# EAGLE design ble_minirc (EAGLE 8.7.0)
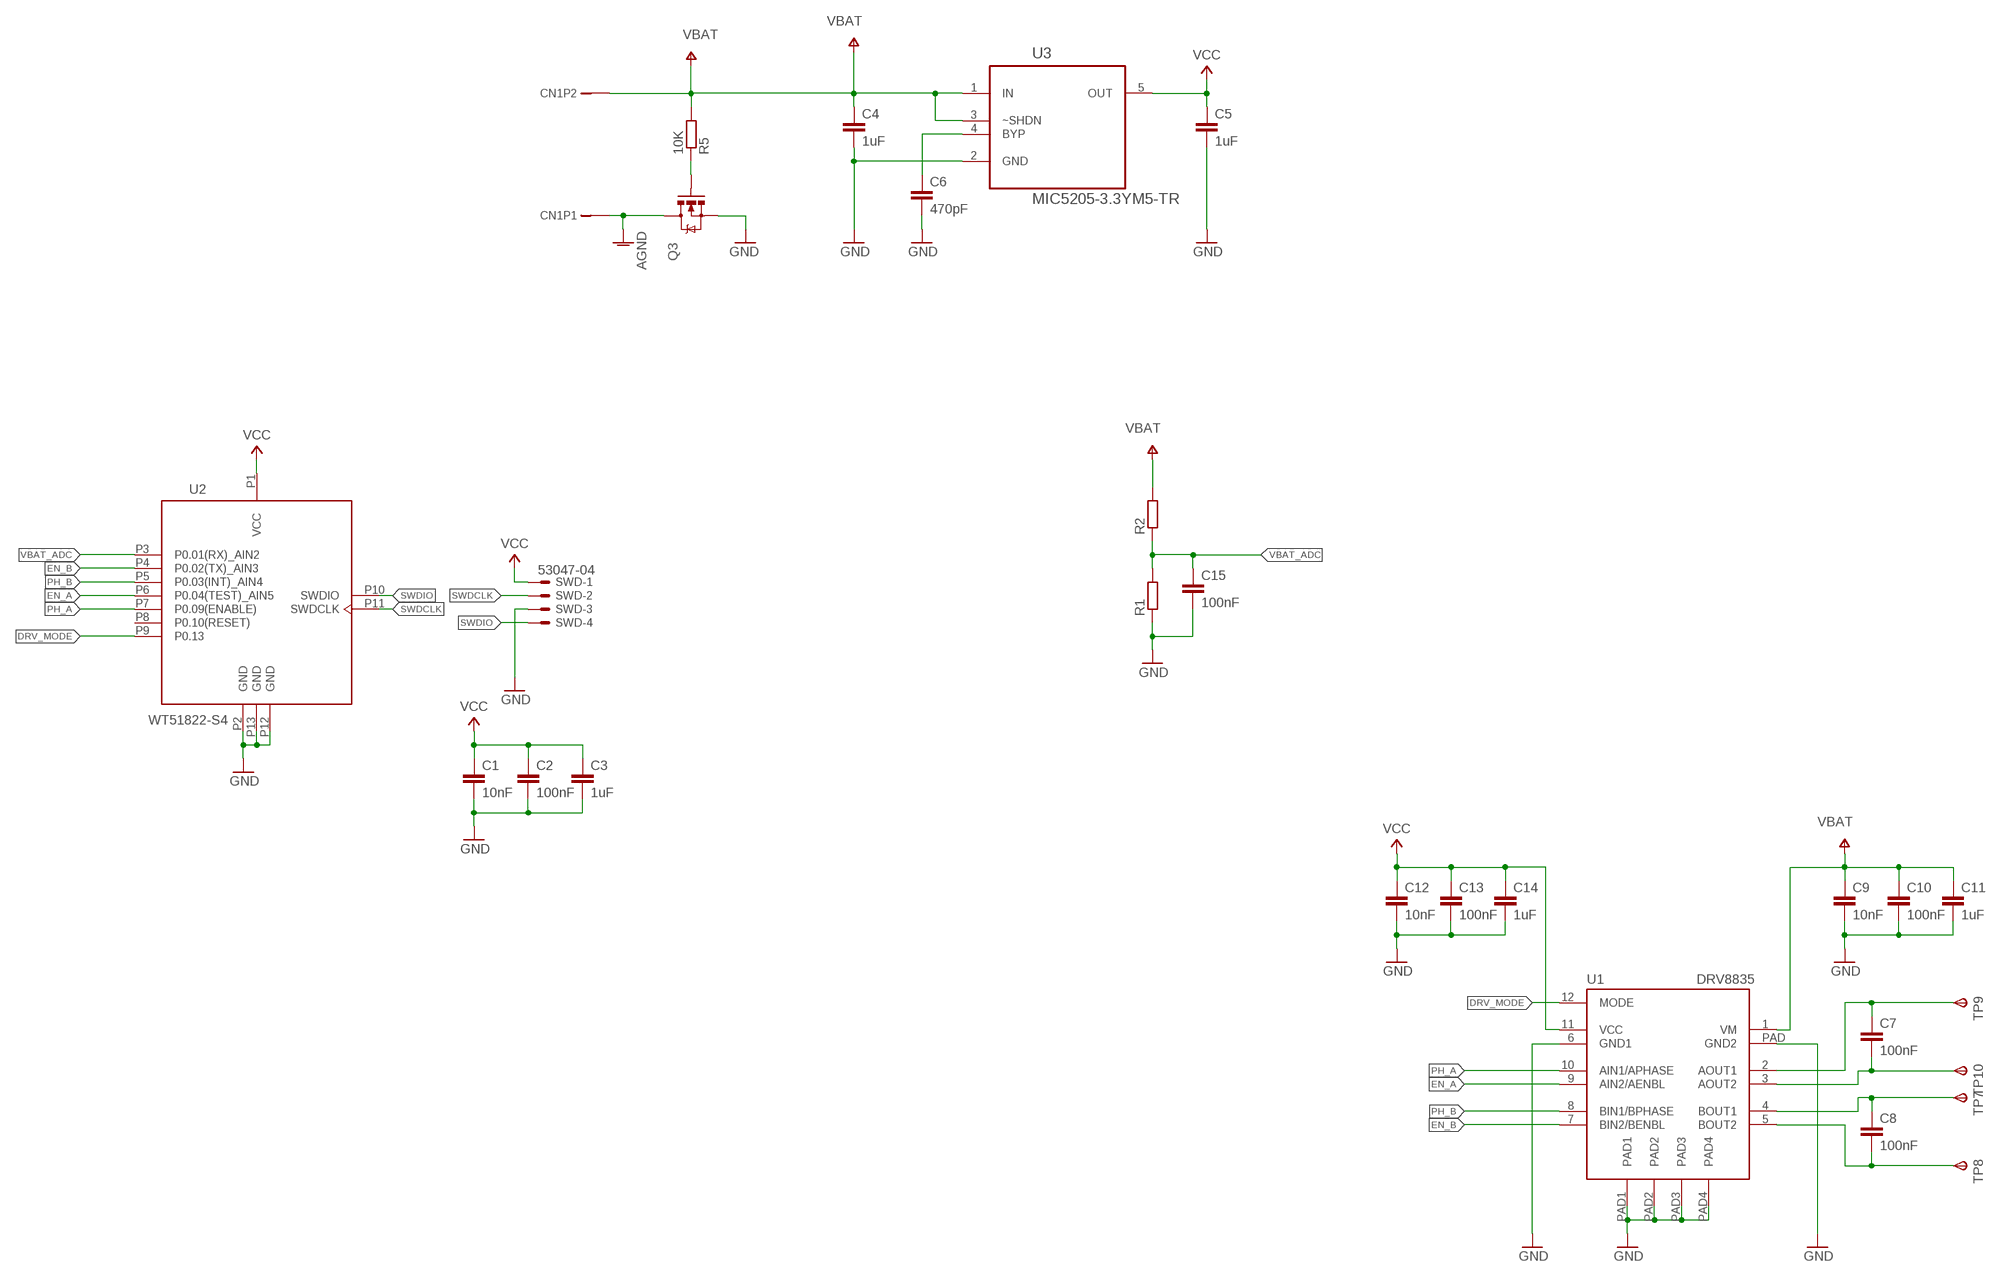
[diagram p0: schematic, sheet 1]

## Parts
C1  10nF  C-EUC0603  [C0603]
C2  100nF  C-EUC0603  [C0603]
C3  1uF  C-EUC0603  [C0603]
C4  1uF  C-EUC0603  [C0603]
C5  1uF  C-EUC0603  [C0603]
C6  470pF  C-EUC0603  [C0603]
C7  100nF  C-EUC0603  [C0603]
C8  100nF  C-EUC0603  [C0603]
C9  10nF  C-EUC0603  [C0603]
C10  100nF  C-EUC0603  [C0603]
C11  1uF  C-EUC0603  [C0603]
C12  10nF  C-EUC0603  [C0603]
C13  100nF  C-EUC0603  [C0603]
C14  1uF  C-EUC0603  [C0603]
C15  100nF  C-EUC0603  [C0603]
CN1  B2B-PH-K-S  [B2B-PH-K-S]
Q3  MOSFET-NCHANNELSMD  [SOT23-3]
R1  R-EU_R0603  [R0603]
R2  R-EU_R0603  [R0603]
R5  10K  R-EU_R0603  [R0603]
SWD  53047-04  [53047-04]
TP7  TPSB1,27  [B1,27]
TP8  TPSB1,27  [B1,27]
TP9  TPSB1,27  [B1,27]
TP10  TPSB1,27  [B1,27]
U1  DRV8835  [WSON_2X3]
U2  WT51822-S4  WT51822-S4ATMODULE  [WT51822-S4AT]
U3  MIC5205-3.3YM5-TR  LT1761ES5-3.3TRMPBF  [SOT95P280X145-5N]

## Nets
A1: C7.1 TP9.TP(PP) U1.2(AOUT1)
A2: C7.2 TP10.TP(PP) U1.3(AOUT2)
AGND: CN1.1 Q3.3(D)
ANTISTUPID_GATE: Q3.1(G) R5.1
B1: C8.1 TP7.TP(PP) U1.4(BOUT1)
B2: C8.2 TP8.TP(PP) U1.5(BOUT2)
DRV_MODE: U1.12(MODE) U2.P9(P0.13)
EN_A: U1.9(AIN2/AENBL) U2.P6(P0.04(TEST)_AIN5)
EN_B: U1.7(BIN2/BENBL) U2.P4(P0.02(TX)_AIN3)
GND: C1.2 C2.2 C3.2 C4.2 C5.2 C6.2 C9.2 C10.2 C11.2 C12.2 C13.2 C14.2 C15.2 Q3.2(S) R1.1 SWD.3 U1.6(GND1) U1.PAD1 U1.PAD2 U1.PAD3 U1.PAD4 U1.PAD(GND2) U2.P2(GND) U2.P12(GND) U2.P13(GND) U3.2(GND)
MIC_BYPASS: C6.1 U3.4(BYP)
PH_A: U1.10(AIN1/APHASE) U2.P7(P0.09(ENABLE))
PH_B: U1.8(BIN1/BPHASE) U2.P5(P0.03(INT)_AIN4)
SWDCLK: SWD.2 U2.P11(SWDCLK)
SWDIO: SWD.4 U2.P10(SWDIO)
VBAT: C4.1 C9.1 C10.1 C11.1 CN1.2 R2.2 R5.2 U1.1(VM) U3.1(IN) U3.3(~SHDN)
VBAT_ADC: C15.1 R1.2 R2.1 U2.P3(P0.01(RX)_AIN2)
VCC: C1.1 C2.1 C3.1 C5.1 C12.1 C13.1 C14.1 SWD.1 U1.11(VCC) U2.P1(VCC) U3.5(OUT)
Unconnected: U2.P8(P0.10(RESET))

## Library data of the parts
C1-C15 = rcl:C-EU: CAPACITOR, European symbol
CN1 = con-jst:B2B-PH-K-S; OC_TME: B2B-PH-K-S
Q3 = SparkFun:MOSFET-NCHANNEL
R1 R2 R5 = rcl:R-EU_: RESISTOR, European symbol
SWD = con-molex:53?-04: CONNECTOR wire to board 1.25 mm (.049 inch) pitch header; MF: WALDOM/MOLEX; MPN: 53047-0410; OC_FARNELL: 9733060; OC_NEWARK: 38C9900
TP7-TP10 = testpad:TPS: TEST PIN
U1 = bt_motordriver:DRV8835: DRV8835 DUAL LOW VOLTAGE H-BRIDGE IC The DRV8835 provides an integrated motor driver solution for cameras, consumer products, toys, and other low voltage or battery-powered motion control applications. The device has two H-bridge drivers, and can drive two DC motors or one stepper motor, as well as other devices like solenoids. The device has two H-bridge drivers, and drives two DC motors or one stepper motor, as well as other devices like solenoids. The output driver block for each consists of N-channel power MOSFETs configured as an H-bridge to drive the motor winding. An internal charge pump generates gate drive voltages. 1.5-A Maximum Drive Current Per H-Bridge Configure Bridges Parallel for 3-A Drive Curren 0-V to 11-V Motor-Operating Supply-Voltage 2-V to 7-V Logic Supply-Voltage Flexible PWM or PHASE/ENABLE Interface Low-Power Sleep Mode With 95-nA Maximum Supply Current Tiny 2.00-mm × 3.00-mm WSON Package Reference: http://www.ti.com/lit/ds/symlink/drv8835.pdf
U2 = martonmiklos:WT51822-S4AT: WT51822-S4AT is a high performance, low power radio transmit and receive system module use Nordic BLE 4.1 nRF51822 as the controller chips.
U3 = LTC_By_element14_Batch_1:LT1761ES5-3.3TRMPBF: 100mA, Low Noise, LDO Micropower Regulators; MPN: LT1761ES5-3.3#TRMPBF; OC_FARNELL: 1663779; OC_NEWARK: 19P0920; OC_TME: MIC5205-3.3YM5-TR; PACKAGE: SOT-23-5; SUPPLIER: Linear Technology

## Board
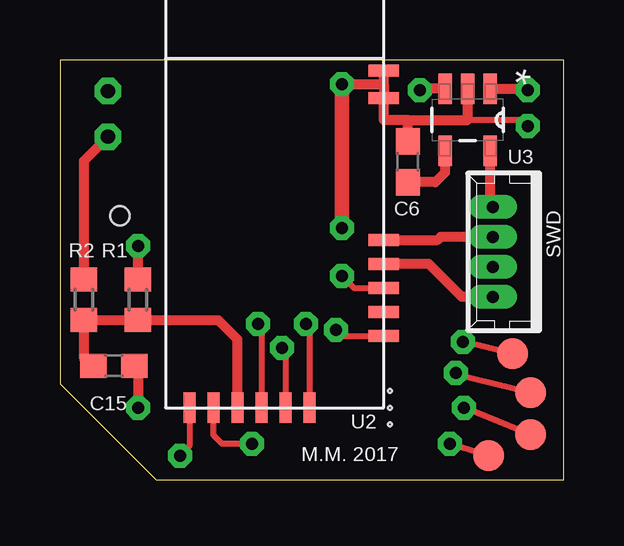
[diagram p1: board, top side]
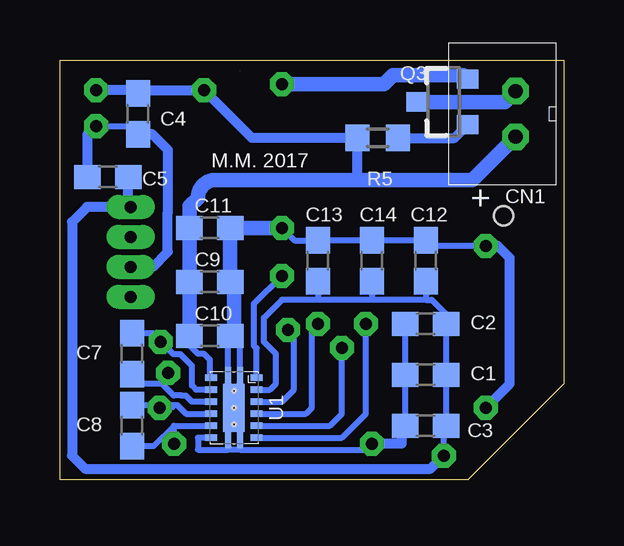
[diagram p2: board, bottom side, seen from below]

Size 21 x 17.5 mm. Coordinates in mm from the lower left corner, seen from the top.
Outline: 4,0 21,0 21,17.5 0,17.5 0,4 4,0
Copper layers (1*16): Top 0.035mm / dielectric 1.5mm / Bottom 0.035mm
Design rules "dirt_cheap_dirty_boards.v1": minimum track width 5mil, minimum drill 0.3mm, track to track 6mil, track to pad 6mil, pad to pad 6mil, via to via 6mil, smd to smd 0mil, copper to edge 10mil, drill to drill 10mil, minimum pad ring 10mil, minimum via ring 6mil, stop-mask expansion 2mil, vias tented up to drill 25mil, thermal gap 10mil
Holes 0.8 mm at 2.5,11

### Footprints (pad centres in the part's own frame; a part is rotated, then mirrored left to right if it is on the bottom)
C0603 = smd 1.1 x 1: 1 -0.85,0; 2 0.85,0
B2B-PH-K-S = drill 0.6 pad 1.016 octagon: 1 1.95,0; 2 0.05,0
SOT23-3 = smd 0.8 x 0.9: 1 -0.95,-1; 2 0.95,-1; 3 0,1.1
R0603 = smd 1 x 1.1: 1 -0.85,0; 2 0.85,0
53047-04 = drill 0.5 pad 0.698 long: 1 1.875,0.45; 2 0.625,0.45; 3 -0.625,0.45; 4 -1.875,0.45
B1,27 = smd 1.27 x 1.27: TP 0,0
WSON_2X3 = smd 0.28 x 0.5: 1 -1.25,-0.95; 2 -0.75,-0.95; 3 -0.25,-0.95; 4 0.25,-0.95; 5 0.75,-0.95; 6 1.25,-0.95; 7 1.25,0.95; 8 0.75,0.95; 9 0.25,0.95; 10 -0.25,0.95; 11 -0.75,0.95; 12 -1.25,0.95 | smd 2 x 0.9: PAD 0,0 | smd 0.7 x 0.25: PAD1 -1.35,0.25; PAD2 -1.35,-0.25; PAD3 1.35,-0.25; PAD4 1.35,0.25 | hole 0.15: 0,0; -0.7,0; 0.7,0
WT51822-S4AT = smd 1.27 x 0.5: P1 0,8.1; P2 0,7.1; P3 0,6.1; P4 0,5.1; P5 0,4.1; P6 0,3.1 | smd 0.5 x 1.27: P7 3,0; P8 4,0; P9 5,0; P10 6,0; P11 7,0; P12 12.9,0; P13 14.05,0
SOT95P280X145-5N = smd 1.27 x 0.559: 1 -1.295,0.94; 2 -1.295,0; 3 -1.295,-0.94; 4 1.295,-0.94; 5 1.295,0.94

### Placement (x,y rotation side)
C1  5.75,4.38 180 bottom
C2  5.75,6.5 180 bottom
C3  5.75,2.25 180 bottom
C4  17.75,15.25 270 bottom
C5  19,12.62 180 bottom
C6  14.5,13.25 90 top
C7  18,5.25 270 bottom
C8  18,2.25 270 bottom
C9  14.75,8.25 0 bottom
C10  14.75,6 0 bottom
C11  14.75,10.5 0 bottom
C12  5.75,9.12 90 bottom
C13  10.25,9.12 90 bottom
C14  8,9.12 90 bottom
C15  2.25,4.75 0 top
CN1  2,14.25 90 bottom
Q3  5,15.75 90 bottom
R1  3.25,7.5 270 top
R2  1,7.5 90 top
R5  7.75,14.25 180 bottom
SWD  18.5,9.5 90 top
TP7  19.62,1.88 90 top
TP8  17.88,1 90 top
TP9  18.88,5.25 90 top
TP10  19.62,3.62 90 top
U1  13.75,3 270 bottom
U2  13.5,3 90 top
U3  17,15 270 top

### Tracks (layer width: path | path; a pad name or v marks a point on that pad's centre or on a via)
A1  (via drill 0.5 pad 1)
  Top 0.254: TP9.TP 16.88,5.75 v16.8,5.75 16.75,5.75
  Bottom 0.254: U1.2 15.32,3.75 15.5,3.92 15.5,4.75 15.97,5.22 16.27,5.22 16.43,5.38 16.43,5.43 16.8,5.8 | C7.1 17.1,6.1 16.8,5.8 | v16.8,5.75 16.8,5.8
A2  (via drill 0.5 pad 1)
  Top 0.254: v16.5,4.44 16.56,4.38 TP10.TP
  Bottom 0.254: U1.3 15.5,3.25 15.75,3.5 15.93,3.5 15.93,3.51 16.26,3.51 16.75,4 | 16.75,4 17.6,4 C7.2 | v16.5,4.44 16.5,4.25 16.75,4
AGND
  Bottom 0.61: Q3.3 2.45,15.75 CN1.1
ANTISTUPID_GATE
  Bottom 0.406: R5.1 4.55,14.25 Q3.1
B1  (via drill 0.5 pad 1)
  Top 0.254: TP7.TP 16.88,3 16.75,2.9 v16.85,3
  Bottom 0.254: U1.4 15.75,2.75 16.1,3.1 16.25,3.1 | 16.25,3.1 C8.1 | 16.25,3.1 16.35,3 v16.85,3
B2  (via drill 0.5 pad 1)
  Top 0.254: TP8.TP v16.25,1.5
  Bottom 0.254: 16.25,2.25 17.1,1.4 C8.2 | 16.25,2.25 U1.5 | v16.25,1.5 16.25,2.25
DRV_MODE  (via drill 0.5 pad 1)
  Top 0.254: v11.75,8.5 12.25,8 U2.P9
  Bottom 0.254: U1.12 12.8,5.47 12.91,5.58 12.91,7.34 v11.75,8.5
EN_A  (via drill 0.5 pad 1)
  Top 0.254: v10.25,6.5 arc-90 10.4,6.35 U2.P6
  Bottom 0.254: U1.9 10.75,2.75 10.5,3 10.5,6.25 v10.25,6.5
EN_B  (via drill 0.5 pad 1)
  Top 0.254: v8.25,6.5 arc-90 8.4,6.35 U2.P4
  Bottom 0.254: U1.7 9.25,1.75 8.25,2.75 v8.25,6.5
GND  (via drill 0.5 pad 1)  (1 unrouted)
  Top 0.254: v19.5,14.75 arc90 19.25,15 17,15 | v8,1.5 6.75,1.5 6.4,1.85 U2.P2
  Top 0.406: 13.5,16.5 U2.P12 13.5,15 14.5,15 | 13.5,16.5 U2.P13 | U3.2 17,15 14.5,15 | v11.75,16.5 13.5,16.5 | C15.2 3.25,4.6 v3.25,3 | R1.1 v3.25,9.75 | C6.2 14.5,15
  Top 0.61: v11.75,10.5 v11.75,16.5
  Bottom 0.254: 6.67,2.17 C3.2 C1.2 C2.2 | C13.2 C14.2 C12.2 5.9,9.75 v3.25,9.75 | C13.2 10.5,9.97 | 10.5,9.97 10.4,9.85 10.25,9.75 | 10.25,9.75 10.6,9.75 10.5,9.97 | C13.2 11.22,9.97 v11.75,10.5 | C13.2 10.25,9.75 | U1.PAD3 14,1.91 | C4.2 17.6,14.75 v19.5,14.75 | v8,1.5 8.25,1.25 13.5,1.25 | U1.PAD3 14,2.15 U1.PAD 13.5,3.85 U1.PAD1 13.5,5.85 13.75,5.85 | 14,1.25 U1.PAD3 | 13.5,1.25 14,1.25 | U1.PAD4 13.5,1.25 | U1.PAD2 14,6 C10.2 | U1.6 15.25,1.75 15.25,1.25 14,1.25
  Bottom 0.406: v3.25,3 2.25,4 2.25,9.25 2.75,9.75 v3.25,9.75 | SWD.3 17.12,8.88 16.51,9.49 16.51,11.15 16.5,11.15 16.5,13.75 17.15,14.4 C4.2 | C5.2 19.85,14.4 v19.5,14.75 | v8,1.5 6.75,1.5 6.75,2.1 6.67,2.17
  Bottom 0.61: C10.2 13.75,5.85 13.75,7.85 C9.2 C11.2 v11.75,10.5 | Q3.2 4.17,16.88 7.12,16.88 7.5,16.5 v11.75,16.5
MIC_BYPASS
  Top 0.406: U3.4 16.06,12.81 15.65,12.4 C6.1
PH_A  (via drill 0.5 pad 1)
  Top 0.254: v11.5,6.25 11.75,6 U2.P7
  Bottom 0.254: U1.10 11.75,3.25 11.25,3.75 11.25,6 v11.5,6.25
PH_B  (via drill 0.5 pad 1)
  Top 0.254: v9.25,5.5 9.4,5.35 U2.P5
  Bottom 0.254: U1.8 9.75,2.25 9.25,2.75 v9.25,5.5
SWDCLK
  Top 0.406: U2.P11 15.75,10 15.88,10.12 SWD.2
SWDIO
  Top 0.406: SWD.4 16.75,7.62 15.38,9 U2.P10
VBAT  (via drill 0.5 pad 1)
  Top 0.406: U3.3 15.04,16.3 v15,16.25 | U3.1 19.2,16.3 v19.5,16.25 | R2.2 1,13.3 CN1.2
  Bottom 0.254: 17.75,16.25 C4.1 17.85,16.1 18,16.25 | U1.1 14.75,4.3 14.75,5 15,5.25 15.25,5.25 15.6,5.6 C10.1
  Bottom 0.406: v19.5,16.25 18,16.25 17.75,16.25 v15,16.25 13,14.25 R5.2 8.6,12.6 8.5,12.5 | 3.8,12.5 8,12.5
  Bottom 0.61: C10.1 C9.1 C11.1 15.6,11.4 15.25,11.75 arc90 14.5,12.5 8.5,12.5 3.8,12.5 CN1.2
VBAT_ADC
  Top 0.406: 1.25,4.9 C15.1 arc-90 1,5.15 R2.1 R1.2 6.6,6.65 7.4,5.85 U2.P3
VCC  (via drill 0.5 pad 1)
  Top 0.254: U2.P1 5.4,1.4 v5,1
  Top 0.406: SWD.1 17.94,11.52 U3.5
  Bottom 0.254: v5,1 5,2.15 C3.1 C1.1 C2.1 4.9,6.9 5.5,7.5 5.75,7.5 | U1.11 12.25,3.75 12,4 12,5.25 12.5,5.75 12.5,6.75 11.75,7.5 10.25,7.5 | 8,7.5 10.25,7.5 | 5.75,7.5 8,7.5 | C13.1 10.25,7.5 | C14.1 8,7.5 | C12.1 5.75,7.5
  Bottom 0.406: C5.1 18.15,11.47 SWD.1 19.88,11.38 20.5,10.75 20.5,1 19.96,0.46 5.54,0.46 v5,1

### Text on the board
tNames: M.M. 2017
bNames: M.M. 2017 | +